# Altium schematic sheet Sheet1.SchDoc
size A4; SheetNumber: 1; SheetTotal: 1; SPICEModelCacheADNSXBRB: <root> / <DocumentId>ADNSXBRB</DocumentId> / <CacheFrame Number="0"> / <Model Name="10tq035" Kind="MDL"> / <Text>*10TQ035 MCE 3/26/98 / *Ref: IR Power Semiconductors Product Digest '94 / *MCE 35V 10A 3us pkg:TO-220 3,1 / .MODEL 10TQ035 D (IS=14.2N RS=4.2M N=1.7 BV=35 IBV=15M / + CJO=412P VJ=0.75 M=0.333 TT=4.32U EG=.69 XTI=2)</Text> / </Model> / </CacheFrame> / </root>
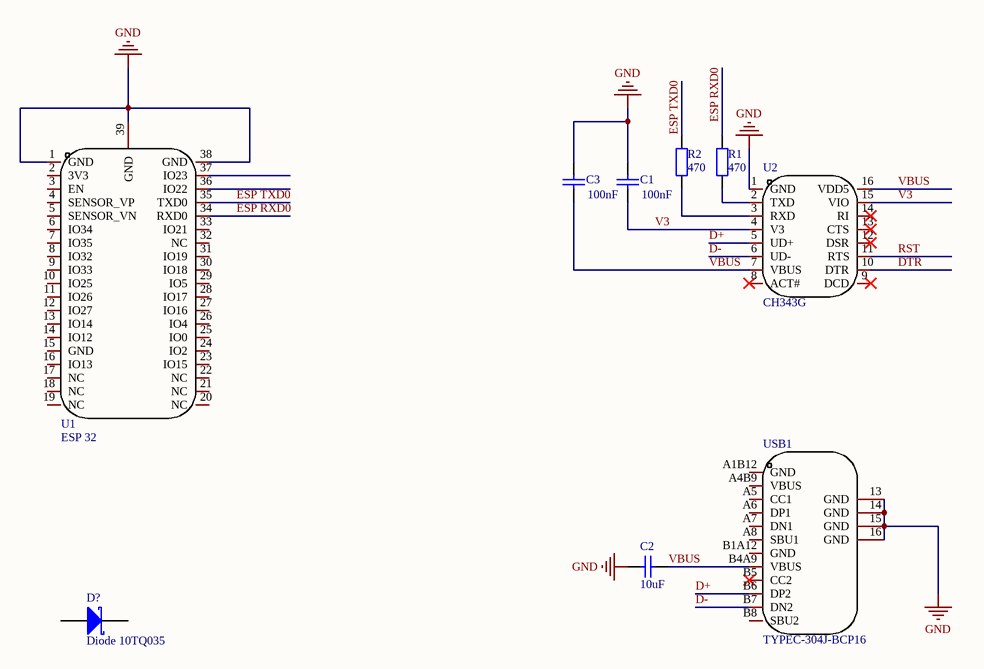
[diagram p0: Sheet1.SchDoc]

## Parts
C1  value 100nF  [RAD-0.3]  (hidden comment: Cap)
C2  value 10uF  [RAD-0.3]  (hidden comment: Cap)
C3  value 100nF  [RAD-0.3]  (hidden comment: Cap)
D?  Diode 10TQ035  [TO-220AC]
R1  value 470  [AXIAL-0.4]  (hidden comment: Res2)
R2  value 470  [AXIAL-0.4]  (hidden comment: Res2)
U1  ESP 32  [PCBComponent_1]
U2  CH343G  [SOP-16_L10.0-W3.9-P1.27-LS6.0-BL]
USB1  TYPEC-304J-BCP16  [USB-C-SMD_TYPEC-304J-BCP16]

## Nets
GND: C1.2 C2.2 C3.2 U1.1(GND) U1.38(GND) U1.39(GND) U2.1(GND) USB1.13(GND) USB1.14(GND) USB1.15(GND) USB1.16(GND)
D+: U2.5(UD+) USB1.B6(DP2)
D-: U2.6(UD-) USB1.B7(DN2)
DTR: U2.10(DTR)
ESP RXD0: R1.2 U1.34(RXD0)
ESP TXD0: R2.2 U1.35(TXD0)
RST: U2.11(RTS)
V3: C1.1 U2.4(V3) U2.15(VIO)
VBUS: C2.1 C3.1 U2.7(VBUS) U2.16(VDD5) USB1.B4A9(VBUS)
NetR1_1: R1.1 U2.2(TXD)
NetR2_1: R2.1 U2.3(RXD)

Not connected (* = marked no-connect by the designer): D? 1(K) 3(A); U1 2(3V3) 3(EN) 4(SENSOR_VP) 5(SENSOR_VN) 6(IO34) 7(IO35) 8(IO32) 9(IO33) 10(IO25) 11(IO26) 12(IO27) 13(IO14) 14(IO12) 15(GND) 16(IO13) 17(NC) 18(NC) 19(NC) 20(NC) 21(NC) 22(NC) 23(IO15) 24(IO2) 25(IO0) 26(IO4) 27(IO16) 28(IO17) 29(IO5) 30(IO18) 31(IO19) 32(NC) 33(IO21) 36(IO22) 37(IO23); U2 8(ACT#)* 9(DCD)* 12(DSR)* 13(CTS)* 14(RI)*; USB1 A1B12(GND) A4B9(VBUS) A5(CC1) A6(DP1) A7(DN1) A8(SBU1) B1A12(GND) B5(CC2)* B8(SBU2)

## Library data of the parts
C1-C3 = Cap: Capacitor; Published: 8-Jun-2000; LatestRevisionDate: 17-Jul-2002; LatestRevisionNote: Re-released for DXP Platform.; PackageReference: RAD-0.3; Publisher: Altium Limited; PackageDescription: Radial Cap, Thru-Hole; 2 Leads; 0.3 in Pin Spacing
D? = Diode 10TQ035: Schottky Rectifier; Note: Terminal 2 is the TAB and is electrically connected to the cathode; Published: 8-Jun-2000; LatestRevisionDate: 17-Jul-2002; LatestRevisionNote: Re-released for DXP Platform.; DatasheetVersion: PD-2.057B; PackageVersion: Feb-1998; PackageReference: TO-220AC; Publisher: Altium Limited; PackageDescription: TO, Thru-Hole, Vertical, Heatsink Mounted; 3 In-Line Leads (1 Absent); Pitch 2.54 mm; ComponentLink1Description: Manufacturer Link; ComponentLink1URL: http://www.irf.com/; ComponentLink2Description: Datasheet; ComponentLink2URL: http://www.irf.com/product-info/datasheets/data/10tq.pdf
R1 R2 = Res2: Resistor; Published: 8-Jun-2000; LatestRevisionDate: 17-Jul-2002; LatestRevisionNote: Re-released for DXP Platform.; PackageReference: AXIAL-0.4; Publisher: Altium Limited; PackageDescription: Axial Device, Thru-Hole; 2 Leads; 0.4 in Pin Spacing
U1 = Component_1
U2 = CH343G: Manufacturer: WCH(南京沁恒); Add into BOM: yes; Symbol: CH343G; Device: CH343G; Supplier: LCSC; Supplier Part: C2844153; Manufacturer Part: CH343G; JLCPCB Part Class: 扩展库; LCSC Part Name: CH343G; Supplier Footprint: SOP-16; Datasheet: https://atta.szlcsc.com/upload/public/pdf/source/20211010/C2846043_7FA705E1F14A2906F6A2AFA45FA28209.pdf; Convert to PCB: yes; Applications Function: -; Protocol: -; Name: CH343G
USB1 = TYPEC-304J-BCP16: Manufacturer: XUNPU(讯普); Add into BOM: yes; Connector Type: Type-C; Gender: 母; Number of Ports: 1; Number of Contacts: 16P; Current Rating - Power (Max): 5A; Soldering Temperature(Max): 260℃; Symbol: TYPEC-304J-BCP16; Device: TYPEC-304J-BCP16; Supplier: LCSC; Supplier Part: C2835315; Manufacturer Part: TYPEC-304J-BCP16; JLCPCB Part Class: 扩展库; LCSC Part Name: Type-C 母 卧贴; Supplier Footprint: SMD; Datasheet: https://atta.szlcsc.com/upload/public/pdf/source/20210528/C2835315_A76BD3CF9329D12B6041421AD23BFD66.pdf; Convert to PCB: yes; Standard: USB 3.1; Mounting Style: 卧贴; Operating Temperature Range: -40℃~+85℃; Name: TYPEC-304J-BCP16